# Altium schematic sheet Sheet1.SchDoc: IOT_ReadValue
size A4; SheetNumber: 1; SheetTotal: 1
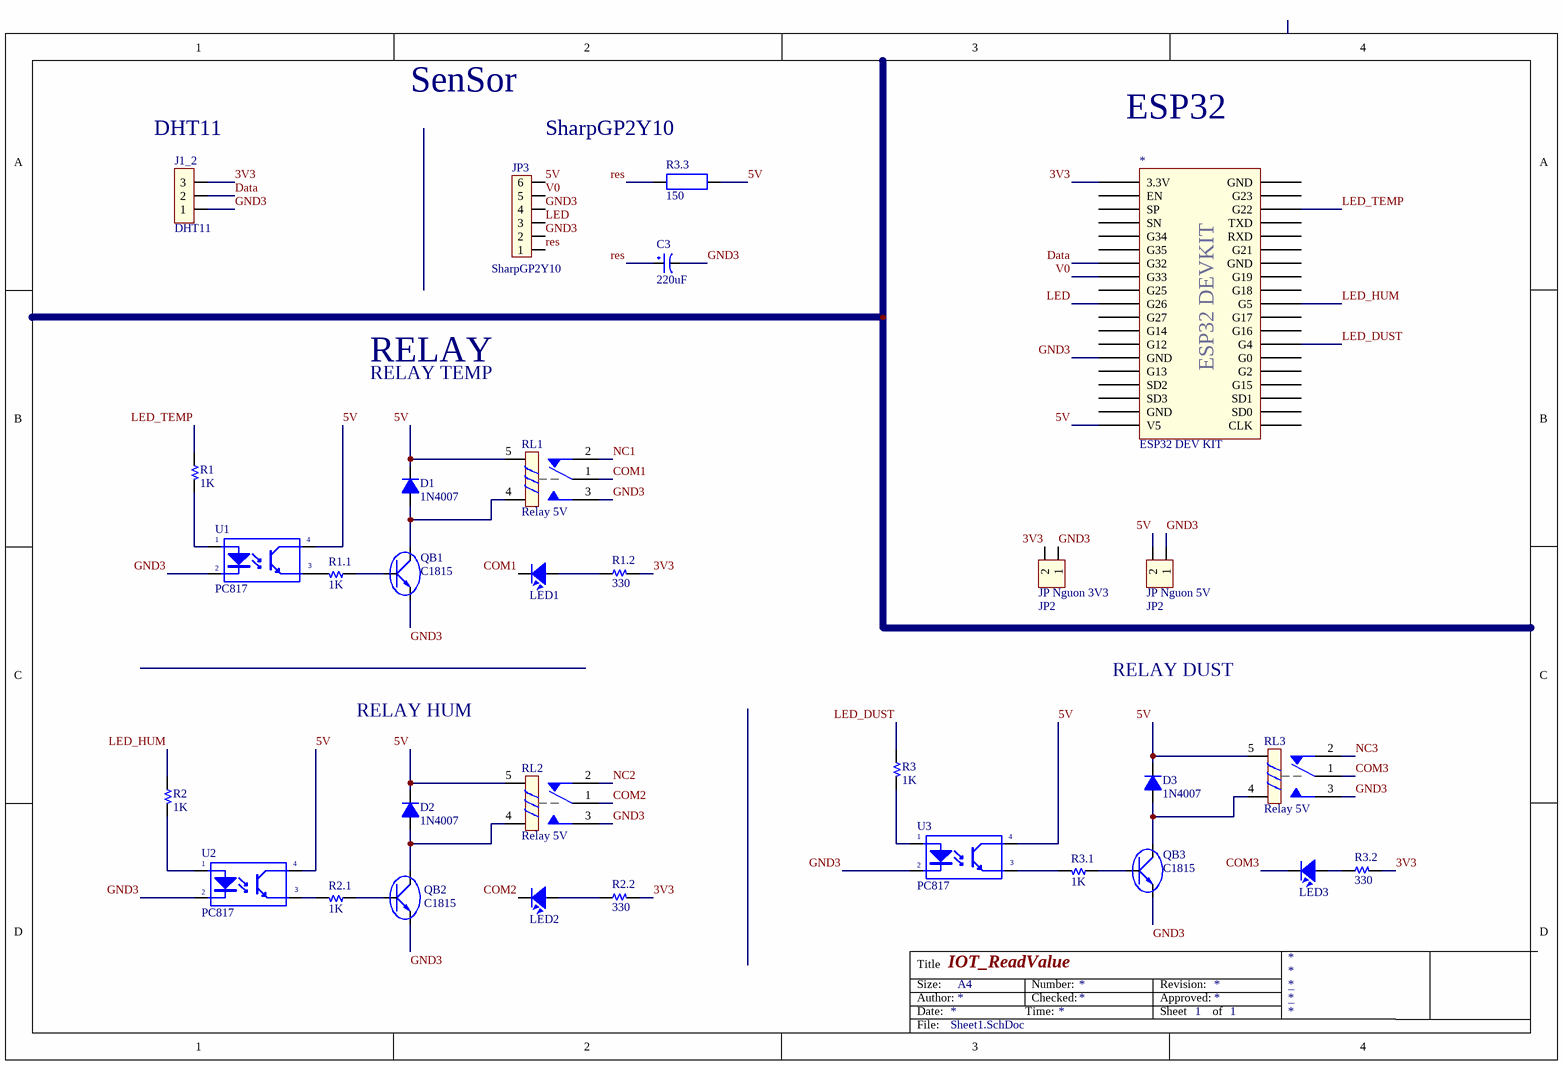
[diagram p0: Sheet1.SchDoc]

## Parts
*  ESP32 DEV KIT  [ESP32 DEVKIT]
C3  220uF  [CP1/2]
D1  1N4007  [D0.5A]
D2  1N4007  [D0.5A]
D3  1N4007  [D0.5A]
J1_2  DHT11  [JP3H]
JP3  SharpGP2Y10  [JP6]
JP_Nguon_3V3  JP2  [CON2]
JP_Nguon_5V  JP2  [CON2]
LED1  LED  [LED-5TRED]  (value not drawn)
LED2  LED  [LED-5TRED]  (value not drawn)
LED3  LED  [LED-5TRED]  (value not drawn)
QB1  C1815  [QTO-247]
QB2  C1815  [QTO-247]
QB3  C1815  [QTO-247]
R1  1K  [R 1/4W/300]
R1.1  1K  [R 1/4W/300]
R1.2  330  [R 1/4W/300]
R2  1K  [R 1/4W/300]
R2.1  1K  [R 1/4W/300]
R2.2  330  [R 1/4W/300]
R3  1K  [R 1/4W/300]
R3.1  1K  [R 1/4W/300]
R3.2  330  [R 1/4W/300]
R3.3  150  [Res_15mm]
RL1  Relay 5V  [RL_SPDT_10A]
RL2  Relay 5V  [RL_SPDT_10A]
RL3  Relay 5V  [RL_SPDT_10A]
U1  PC817  [DIP4/W0.3]
U2  PC817  [DIP4/W0.3]
U3  PC817  [DIP4/W0.3]

## Nets
3V3: *.1(3.3V) J1_2.3 JP_Nguon_3V3.2 R1.2.2 R2.2.2 R3.2.2
5V: *.19(V5) D1.2(K) D2.2(K) D3.2(K) JP3.6 JP_Nguon_5V.2 R3.3.2 RL1.5 RL2.5 RL3.5 U1.4(C) U2.4(C) U3.4(C)
COM1: LED1.2 RL1.1
COM2: LED2.2 RL2.1
COM3: LED3.2 RL3.1
Data: *.7(G32) J1_2.2
GND3: *.14(GND) C3.2 J1_2.1 JP3.2 JP3.4 JP_Nguon_3V3.1 JP_Nguon_5V.1 QB1.3(E) QB2.3(E) QB3.3(E) RL1.3 RL2.3 RL3.3 U1.2(K) U2.2(K) U3.2(K)
LED: *.10(G26) JP3.3
LED_DUST: *.26(G4) R3.1
LED_HUM: *.29(G5) R2.1
LED_TEMP: *.36(G22) R1.1
NC1: RL1.2
NC2: RL2.2
NC3: RL3.2
res: C3.1 JP3.1 R3.3.1
V0: *.8(G33) JP3.5
NetD1_1: D1.1(A) QB1.2(C) RL1.4
NetD2_1: D2.1(A) QB2.2(C) RL2.4
NetD3_1: D3.1(A) QB3.2(C) RL3.4
NetLED1_1: LED1.1 R1.2.1
NetLED2_1: LED2.1 R2.2.1
NetLED3_1: LED3.1 R3.2.1
NetQB1_1: QB1.1(B) R1.1.1
NetQB2_1: QB2.1(B) R2.1.1
NetQB3_1: QB3.1(B) R3.1.1
NetR1.1_2: R1.1.2 U1.3(E)
NetR1_2: R1.2 U1.1(A)
NetR2.1_2: R2.1.2 U2.3(E)
NetR2_2: R2.2 U2.1(A)
NetR3.1_2: R3.1.2 U3.3(E)
NetR3_2: R3.2 U3.1(A)

Not connected (* = marked no-connect by the designer): * 2(EN) 3(SP) 4(SN) 5(G34) 6(G35) 9(G25) 11(G27) 12(G14) 13(G12) 15(G13) 16(SD2) 17(SD3) 18(GND) 20(CLK) 21(SD0) 22(SD1) 23(G15) 24(G2) 25(G0) 27(G16) 28(G17) 30(G18) 31(G19) 32(GND) 33(G21) 34(RXD) 35(TXD) 37(G23) 38(GND)

## Notes on the sheet
- (near J1_2) DHT11
- SenSor
- SharpGP2Y10
- ESP32
- RELAY
- RELAY TEMP
- RELAY DUST
- RELAY HUM
- Title
- Size:
- Date:
- Author:
- A4
- Time:
- Number:
- Checked:
- Revision:
- Sheet
- Approved:
- of
- File:
- (in symbol ESP32 DEV KIT) ESP32 DEVKIT

## Library data of the parts
C3 = CP1: Cap P  0,1uF < 22uF , 16 - 50V; Value: 10uF/50V; Description 1: 10 => 220uF/6,3V/10V - 10uF => 100uF/16V; Description 2: 0,1uF => 33uF/50V - 10uF => 22uF/63V; Description 3: 0,47uF => 10uF/100V
D1-D3 = D1A: Diode 1A; Value: 1N4007
J1_2 = JP3: Jumper 3; Value: J3
JP3 = JP6: JP6 PIN; Value: JP7
JP_Nguon_3V3 JP_Nguon_5V = Con2: Connector 2; Value: Connector 2
LED1-LED3 = LED: LED Single colour Green and Red; Value: LED 3 ly Single Colour
QB1-QB3 = D718: Transistor Power Supply; Value: D718
R1 R1.1 R1.2 R2 R2.1 R2.2 R3 R3.1 R3.2 = Resistor
R3.3 = R1W: Resistor 1W; Value: R1W - 100
RL1-RL3 = Relay 1: Relay SPDT,10A - 12VDC 5 Pin; Value: Relay SPDT, 10A, 12V
U1-U3 = PC817: Single Opto; Value: PC817